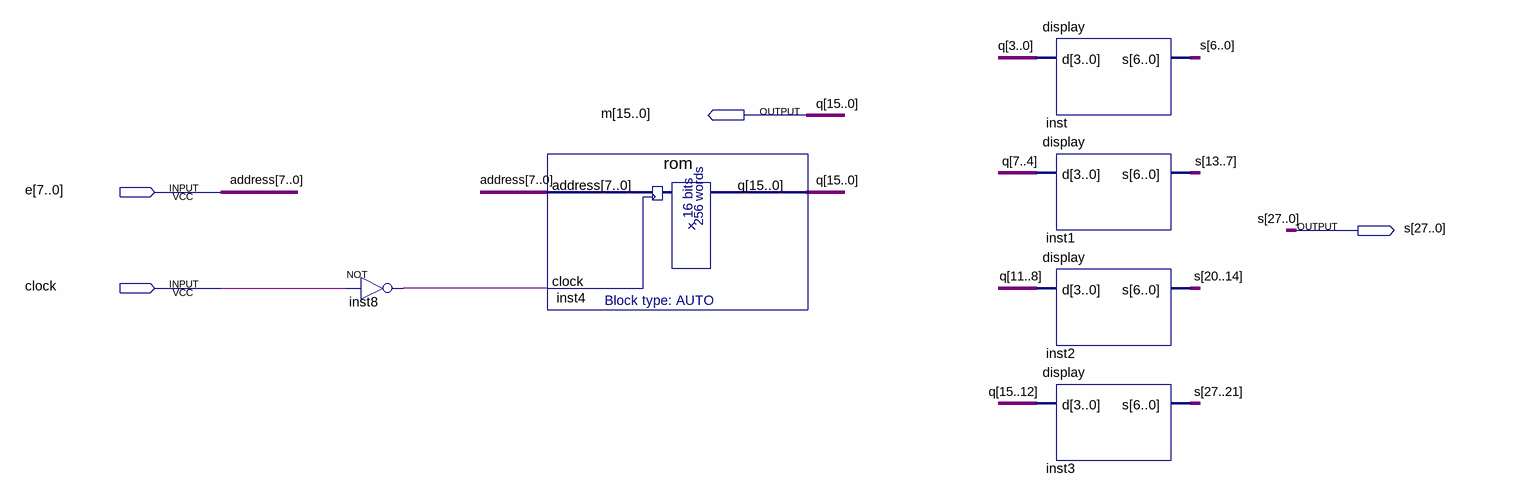
[diagram p0: schematic sheet]
// Quartus schematic memoria.bdf as structural Verilog: 6 symbols, 4 pins
module memoria (
  input  [7:0] e,
  input  clock,
  output [15:0] m,
  output [27:0] s
);

  wire inst8_out;

  not inst8 (inst8_out, clock);
  rom inst4 (.address(e), .clock(inst8_out), .q(m));
  display inst (.d(m[3:0]), .s(s[6:0]));
  display inst1 (.d(m[7:4]), .s(s[13:7]));
  display inst2 (.d(m[11:8]), .s(s[20:14]));
  display inst3 (.d(m[15:12]), .s(s[27:21]));

  // Other names for the same wires on the sheet: address[7:0] = e; q[15:0] = m
endmodule
